# EAGLE design chordie_control_surface (EAGLE 5.10)
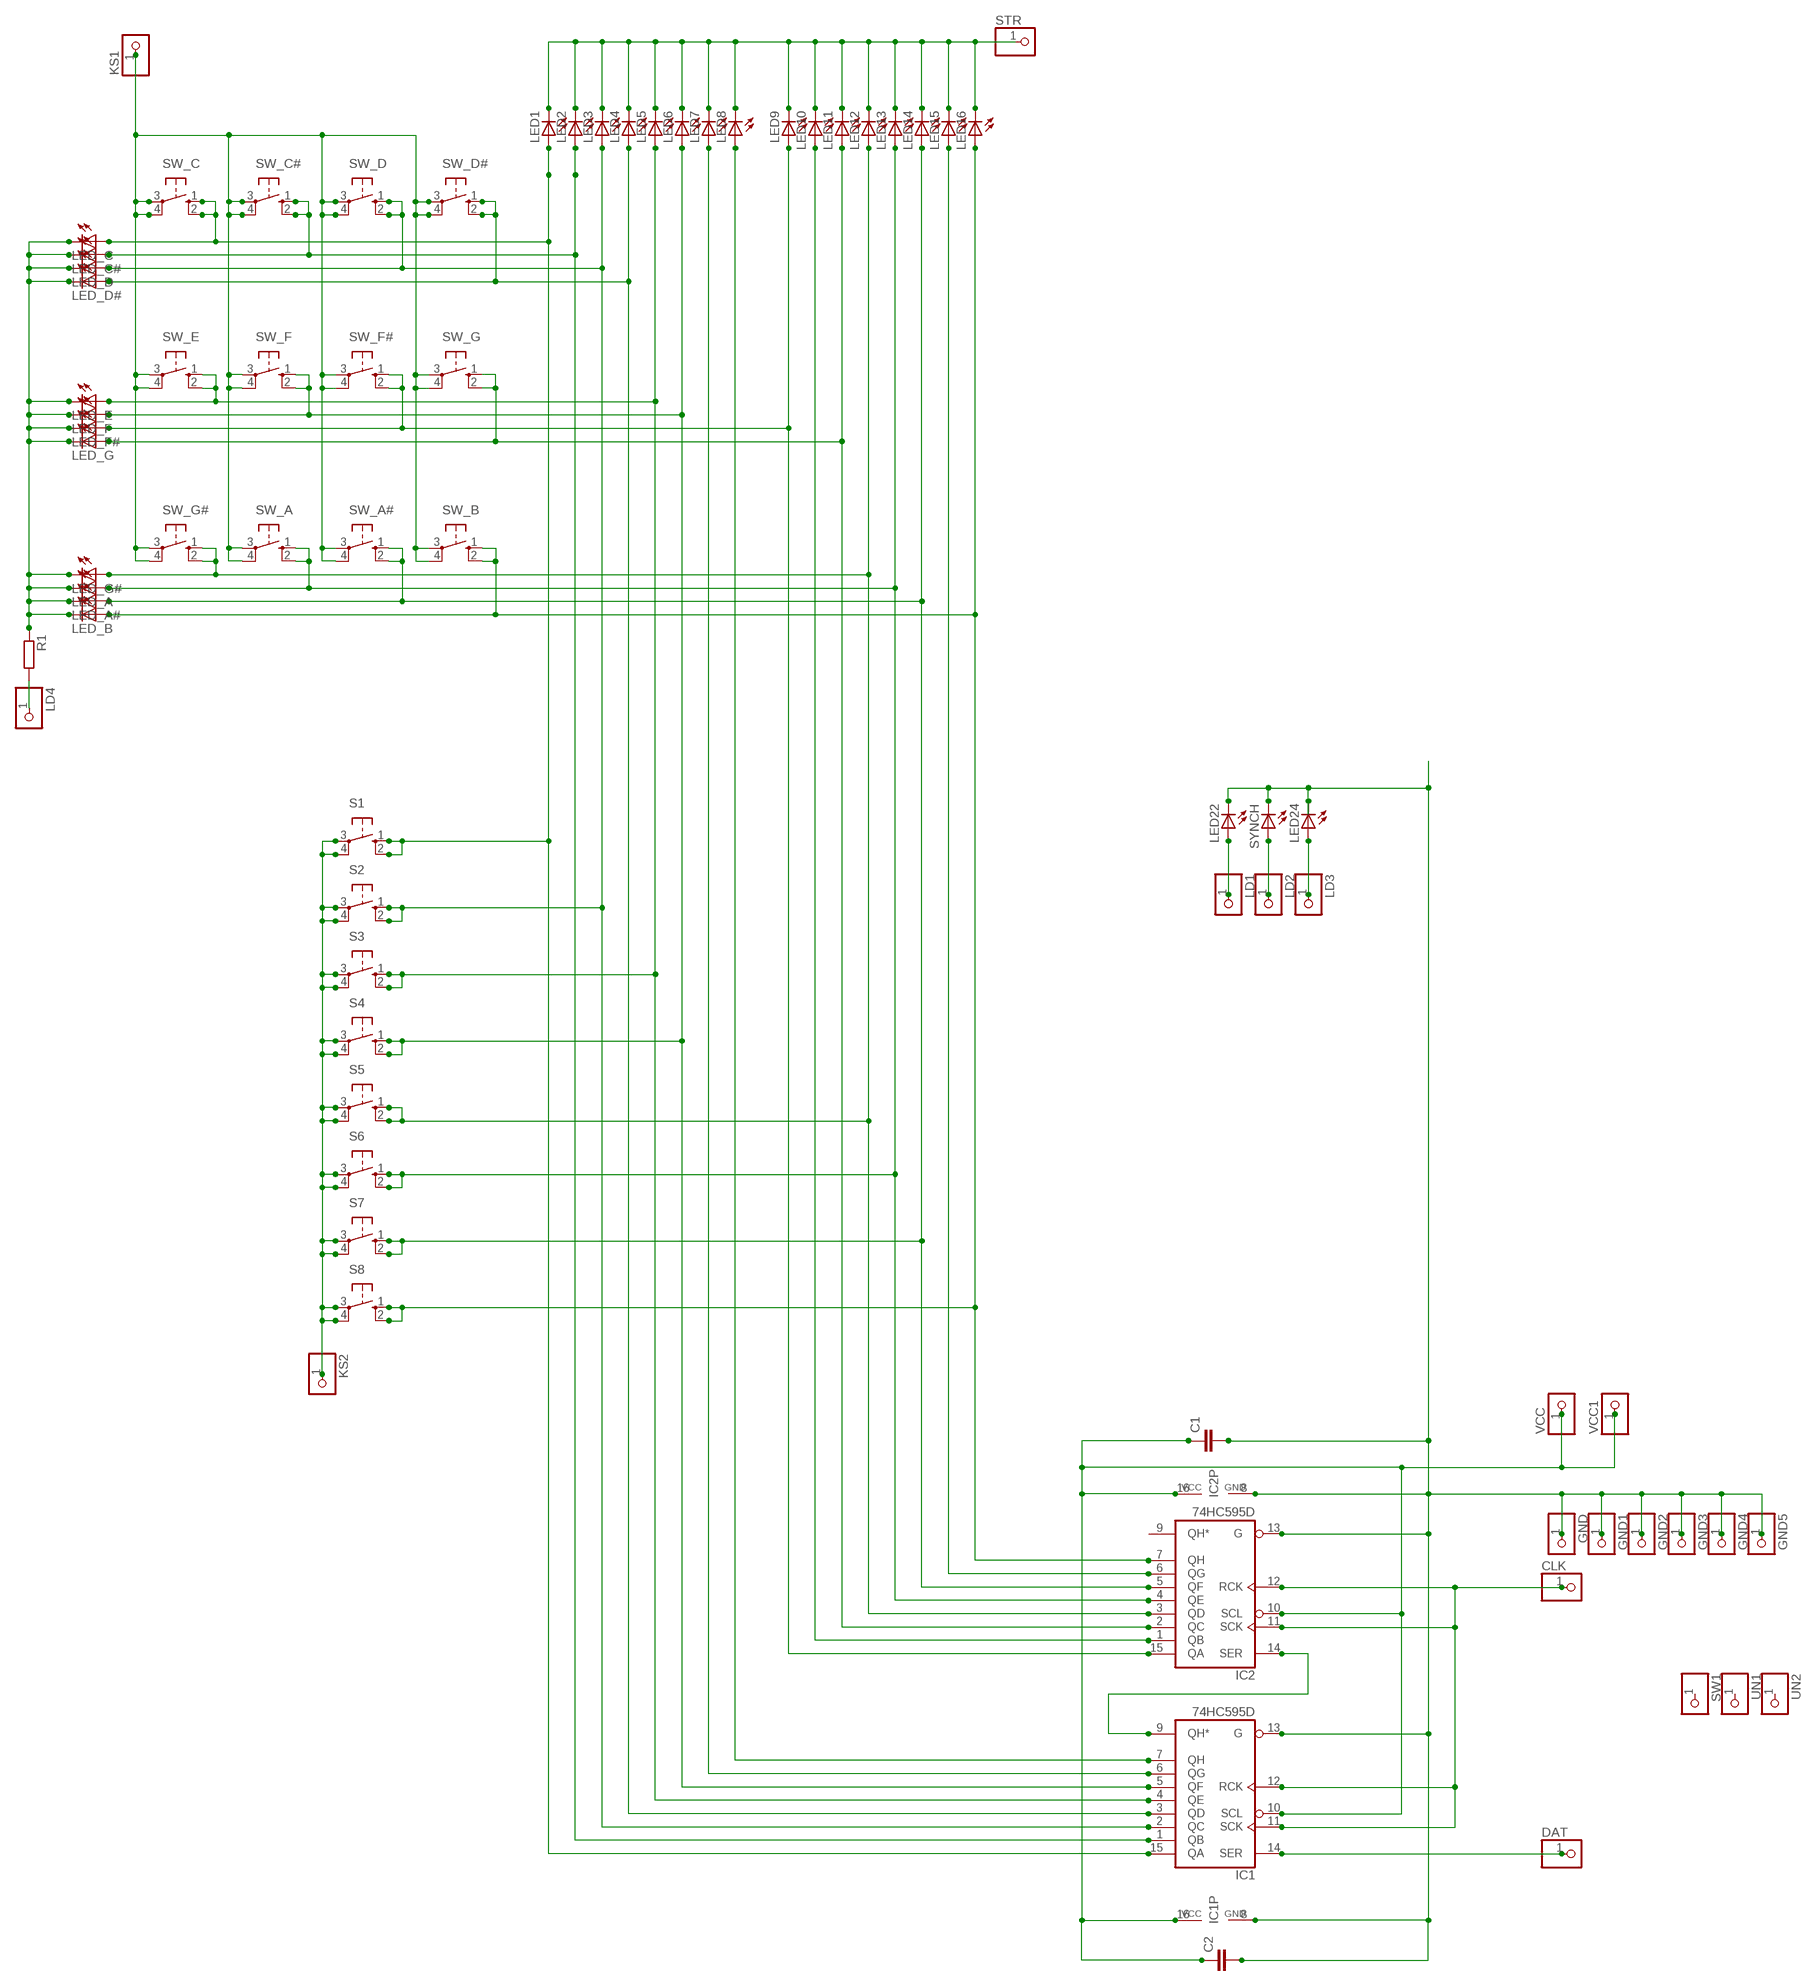
[diagram p0: schematic, sheet 1]

## Parts
C1  C-EUC0805  [C0805]
C2  C-EUC0805  [C0805]
CLK  PINHD-1X1  [1X01]
DAT  PINHD-1X1  [1X01]
GND  PINHD-1X1  [1X01]
GND1  PINHD-1X1  [1X01]
GND2  PINHD-1X1  [1X01]
GND3  PINHD-1X1  [1X01]
GND4  PINHD-1X1  [1X01]
GND5  PINHD-1X1  [1X01]
IC1  74HC595D  [SO16]
IC2  74HC595D  [SO16]
KS1  PINHD-1X1  [1X01]
KS2  PINHD-1X1  [1X01]
LD1  PINHD-1X1  [1X01]
LD2  PINHD-1X1  [1X01]
LD3  PINHD-1X1  [1X01]
LD4  PINHD-1X1  [1X01]
LED1  LED3MM  [LED3MM]
LED2  LED3MM  [LED3MM]
LED3  LED3MM  [LED3MM]
LED4  LED3MM  [LED3MM]
LED5  LED3MM  [LED3MM]
LED6  LED3MM  [LED3MM]
LED7  LED3MM  [LED3MM]
LED8  LED3MM  [LED3MM]
LED9  LED3MM  [LED3MM]
LED10  LED3MM  [LED3MM]
LED11  LED3MM  [LED3MM]
LED12  LED3MM  [LED3MM]
LED13  LED3MM  [LED3MM]
LED14  LED3MM  [LED3MM]
LED15  LED3MM  [LED3MM]
LED16  LED3MM  [LED3MM]
LED22  LED3MM  [LED3MM]
LED24  LED3MM  [LED3MM]
LED_A  LED3MM  [LED3MM]
LED_A#  LED3MM  [LED3MM]
LED_B  LED3MM  [LED3MM]
LED_C  LED3MM  [LED3MM]
LED_C#  LED3MM  [LED3MM]
LED_D  LED3MM  [LED3MM]
LED_D#  LED3MM  [LED3MM]
LED_E  LED3MM  [LED3MM]
LED_F  LED3MM  [LED3MM]
LED_F#  LED3MM  [LED3MM]
LED_G  LED3MM  [LED3MM]
LED_G#  LED3MM  [LED3MM]
R1  R-EU_R0805  [R0805]
S1  10-XX  [B3F-10XX]
S2  10-XX  [B3F-10XX]
S3  10-XX  [B3F-10XX]
S4  10-XX  [B3F-10XX]
S5  10-XX  [B3F-10XX]
S6  10-XX  [B3F-10XX]
S7  10-XX  [B3F-10XX]
S8  10-XX  [B3F-10XX]
STR  PINHD-1X1  [1X01]
SW1  PINHD-1X1  [1X01]
SW_A  40-XX  [B3F-40XX-NOTAB]
SW_A#  40-XX  [B3F-40XX-NOTAB]
SW_B  40-XX  [B3F-40XX-NOTAB]
SW_C  40-XX  [B3F-40XX-NOTAB]
SW_C#  40-XX  [B3F-40XX-NOTAB]
SW_D  40-XX  [B3F-40XX-NOTAB]
SW_D#  40-XX  [B3F-40XX-NOTAB]
SW_E  40-XX  [B3F-40XX-NOTAB]
SW_F  40-XX  [B3F-40XX-NOTAB]
SW_F#  40-XX  [B3F-40XX-NOTAB]
SW_G  40-XX  [B3F-40XX-NOTAB]
SW_G#  40-XX  [B3F-40XX-NOTAB]
SYNCH  LED3MM  [LED3MM]
UN1  PINHD-1X1  [1X01]
UN2  PINHD-1X1  [1X01]
VCC  PINHD-1X1  [1X01]
VCC1  PINHD-1X1  [1X01]

## Nets
DAT: DAT.1 IC1.14(SER)
GND: C1.2 C2.2 GND1.1 GND2.1 GND3.1 GND4.1 GND5.1 GND.1 IC1.8(GND) IC1.13(G) IC2.8(GND) IC2.13(G) LED22.K(C) LED24.K(C) SYNCH.K(C)
LED1: LD1.1 LED22.A
LED2: LD2.1 SYNCH.A
LED3: LD3.1 LED24.A
N$1: IC2.1(QB) LED10.A
N$2: IC1.6(QG) LED7.A
N$3: IC2.3(QD) LED12.A LED_G#.A S5.1(S) S5.2(S1) SW_G#.1(S) SW_G#.2(S1)
N$4: IC1.5(QF) LED6.A LED_F.A S4.1(S) S4.2(S1) SW_F.1(S) SW_F.2(S1)
N$5: IC2.4(QE) LED13.A LED_A.A S6.1(S) S6.2(S1) SW_A.1(S) SW_A.2(S1)
N$6: IC2.2(QC) LED11.A LED_G.A SW_G.1(S) SW_G.2(S1)
N$7: LED_A#.K(C) LED_A.K(C) LED_B.K(C) LED_C#.K(C) LED_C.K(C) LED_D#.K(C) LED_D.K(C) LED_E.K(C) LED_F#.K(C) LED_F.K(C) LED_G#.K(C) LED_G.K(C) R1.1
N$8: LD4.1 R1.2
N$11: KS2.1 S1.3(P) S1.4(P1) S2.3(P) S2.4(P1) S3.3(P) S3.4(P1) S4.3(P) S4.4(P1) S5.3(P) S5.4(P1) S6.3(P) S6.4(P1) S7.3(P) S7.4(P1) S8.3(P) S8.4(P1)
N$12: IC2.6(QG) LED15.A
N$13: IC1.7(QH) LED8.A
N$14: IC1.3(QD) LED4.A LED_D#.A SW_D#.1(S) SW_D#.2(S1)
N$16: IC2.7(QH) LED16.A LED_B.A S8.1(S) S8.2(S1) SW_B.1(S) SW_B.2(S1)
N$17: IC2.5(QF) LED14.A LED_A#.A S7.1(S) S7.2(S1) SW_A#.1(S) SW_A#.2(S1)
N$18: IC2.15(QA) LED9.A LED_F#.A SW_F#.1(S) SW_F#.2(S1)
N$19: LED1.K(C) LED2.K(C) LED3.K(C) LED4.K(C) LED5.K(C) LED6.K(C) LED7.K(C) LED8.K(C) LED9.K(C) LED10.K(C) LED11.K(C) LED12.K(C) LED13.K(C) LED14.K(C) LED15.K(C) LED16.K(C) STR.1
N$20: IC1.4(QE) LED5.A LED_E.A S3.1(S) S3.2(S1) SW_E.1(S) SW_E.2(S1)
N$21: IC1.2(QC) LED3.A LED_D.A S2.1(S) S2.2(S1) SW_D.1(S) SW_D.2(S1)
N$22: IC1.1(QB) LED2.A LED_C#.A SW_C#.1(S) SW_C#.2(S1)
N$23: IC1.15(QA) LED1.A LED_C.A S1.1(S) S1.2(S1) SW_C.1(S) SW_C.2(S1)
N$29: KS1.1 SW_A#.3(P) SW_A#.4(P1) SW_A.3(P) SW_A.4(P1) SW_B.3(P) SW_B.4(P1) SW_C#.3(P) SW_C#.4(P1) SW_C.3(P) SW_C.4(P1) SW_D#.3(P) SW_D#.4(P1) SW_D.3(P) SW_D.4(P1) SW_E.3(P) SW_E.4(P1) SW_F#.3(P) SW_F#.4(P1) SW_F.3(P) SW_F.4(P1) SW_G#.3(P) SW_G#.4(P1) SW_G.3(P) SW_G.4(P1)
N$30: IC1.9(QH*) IC2.14(SER)
SCK: CLK.1 IC1.11(SCK) IC1.12(RCK) IC2.11(SCK) IC2.12(RCK)
VCC: C1.1 C2.1 IC1.10(SCL) IC1.16(VCC) IC2.10(SCL) IC2.16(VCC) VCC1.1 VCC.1
Unconnected: IC2.9(QH*) SW1.1 UN1.1 UN2.1

## Library data of the parts
C1 C2 = rcl:C-EU: CAPACITOR, European symbol
CLK DAT GND GND1-GND5 KS1 KS2 LD1-LD4 STR SW1 UN1 UN2 VCC VCC1 = adafruit:PINHD-1X1: Pin header 1x1 for 0.1" spacing With round pins
IC1 IC2 = 74xx-eu:74*595: 8-bit SHIFT REGISTER, output latch
LED1-LED16 LED22 LED24 LED_A LED_A# LED_B LED_C LED_C# LED_D LED_D# LED_E LED_F LED_F# LED_G LED_G# SYNCH = adafruit:LED: LED OSRAM: - CHIPLED LG R971, LG N971, LY N971, LG Q971, LY Q971, LO R971, LY R971 LH N974, LH R974 LS Q976, LO Q976, LY Q976 LO Q996 - Hyper CHIPLED LW Q18S LB Q993, LB Q99A, LB R99A - SideLED LS A670, LO A670, LY A670, LG A670, LP A670 LB A673, LV A673, LT A673, LW A673 LH A674 LY A675 LS A676, LA A676, LO A676, LY A676, LW A676 LS A679, LY A679, LG A679 - Hyper Micro SIDELED® LS Y876, LA Y876, LO Y876, LY Y876 LT Y87S - SmartLED LW L88C, LW L88S LB L89C, LB L89S, LG L890 LS L89K, LO L89K, LY L89K LS L896, LA L896, LO L896, LY L896 - TOPLED LS T670, LO T670, LY T670, LG T670, LP T670 LSG T670, LSP T670, LSY T670, LOP T670, LYG T670 LG T671, LOG T671, LSG T671 LB T673, LV T673, LT T673, LW T673 LH T674 LS T676, LA T676, LO T676, LY T676, LB T676, LH T676, LSB T676, LW T676 LB T67C, LV T67C, LT T67C, LS T67K, LO T67K, LY T67K, LW E67C LS E67B, LA E67B, LO E67B, LY E67B, LB E67C, LV E67C, LT E67C LW T67C LS T679, LY T679, LG T679 LS T770, LO T770, LY T770, LG T770, LP T770 LB T773, LV T773, LT T773, LW T773 LH T774 LS E675, LA E675, LY E675, LS T675 LS T776, LA T776, LO T776, LY T776, LB T776 LHGB T686 LT T68C, LB T68C - Hyper Mini TOPLED® LB M676 - Mini TOPLED Santana® LG M470 LS M47K, LO M47K, LY M47K Source: http://www.osram.convergy.de/
R1 = rcl:R-EU_: RESISTOR, European symbol
S1-S8 = switch-omron:10-XX: OMRON SWITCH
SW_A SW_A# SW_B SW_C SW_C# SW_D SW_D# SW_E SW_F SW_F# SW_G SW_G# = jasons_stuff:40-XX: OMRON SWITCH

## Board
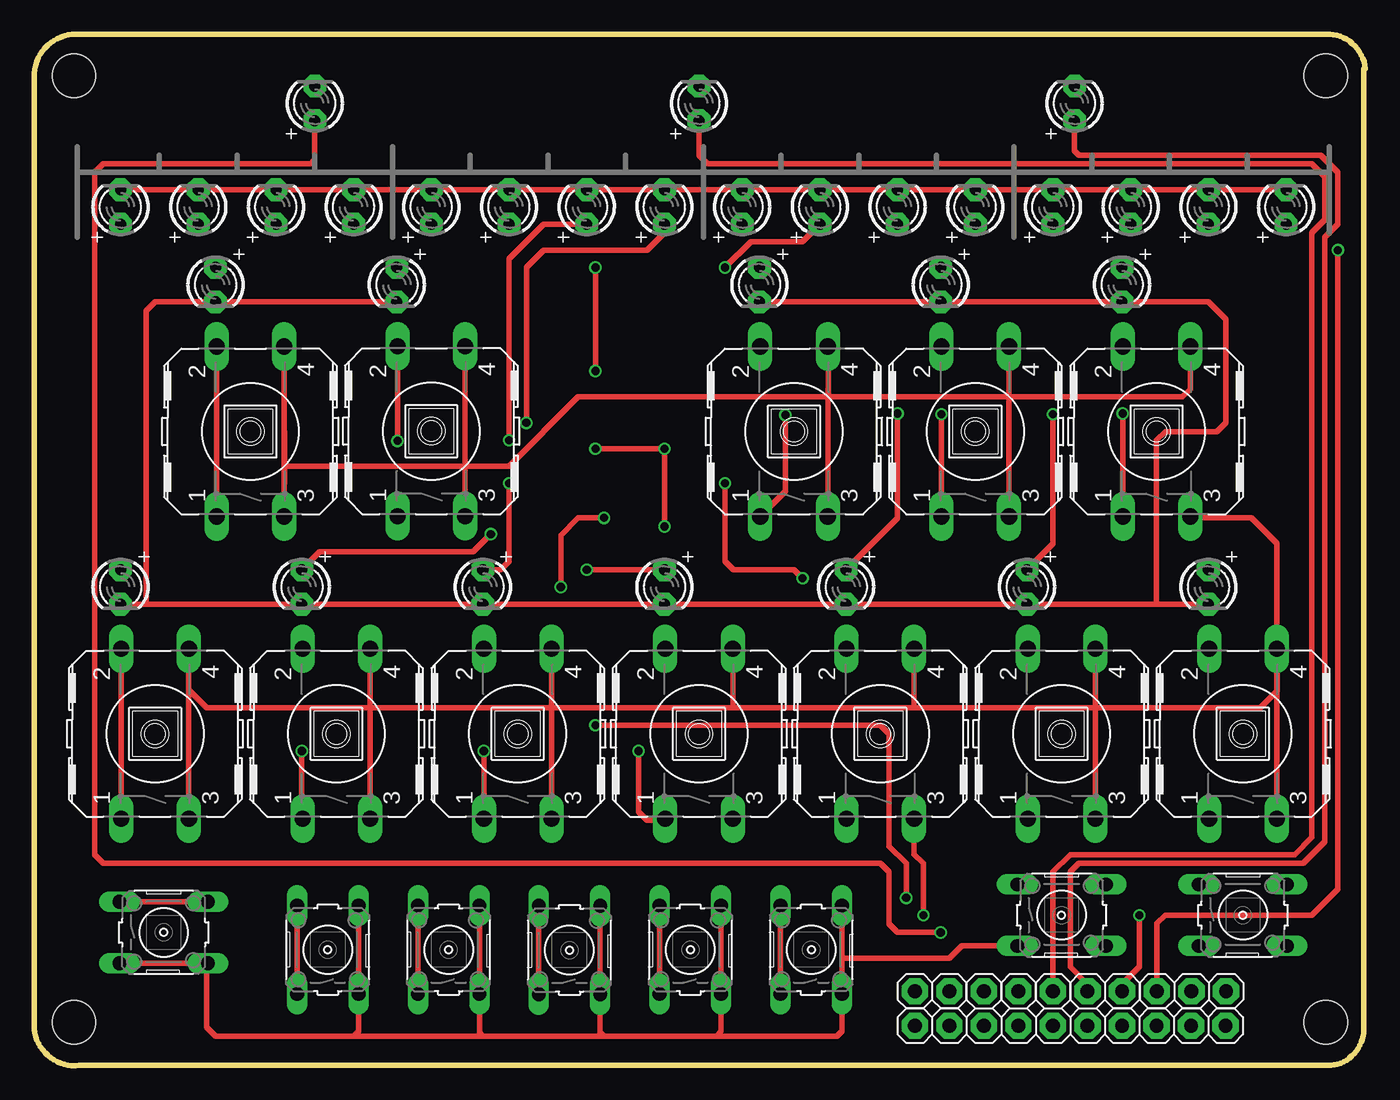
[diagram p1: board, top side]
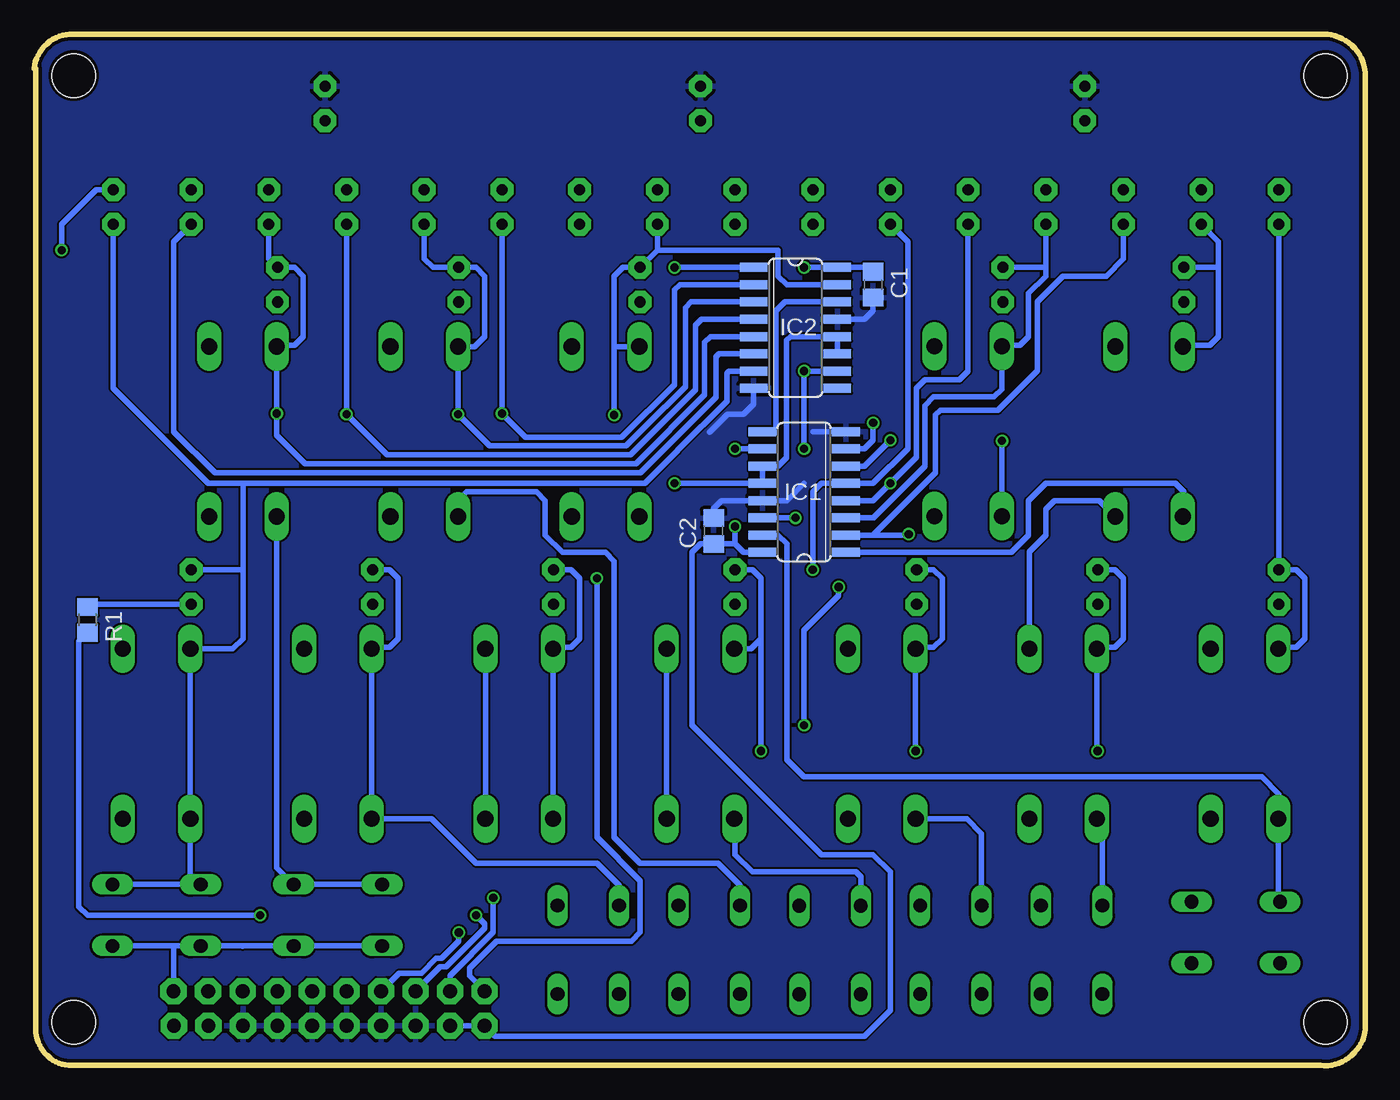
[diagram p2: board, bottom side, seen from below]

Size 97.93 x 75.85 mm. Coordinates in mm from the lower left corner, seen from the top.
Outline: 97.93,73.3 arc90 94.76,75.84 2.81,75.84 arc90 0.02,72.41 0.02,2.68 arc90 3.32,0.02 95.14,0.02 arc90 97.81,2.68 97.81,73.3
Copper layers (1*16): Top 0.035mm / dielectric 1.5mm / Bottom 0.035mm
Design rules "ITEADstudio_DRC": minimum track width 6mil, minimum drill 12mil, track to track 6mil, track to pad 6mil, pad to pad 6mil, via to via 6mil, smd to smd 0mil, copper to edge 10mil, drill to drill 10mil, minimum pad ring 10mil, minimum via ring 6mil, stop-mask expansion 2mil, vias tented up to drill 100mil, thermal gap 10mil
Holes 3.2 mm at 2.94,72.79 2.94,3.19 95.01,72.79 95.01,3.19

### Footprints (pad centres in the part's own frame; a part is rotated, then mirrored left to right if it is on the bottom)
C0805 = smd 1.3 x 1.5: 1 -0.95,0; 2 0.95,0
1X01 = drill 1.016 pad 1.93 octagon: 1 0,0
SO16 = smd 0.66 x 2.032: 1 -4.445,-3.073; 2 -3.175,-3.073; 3 -1.905,-3.073; 4 -0.635,-3.073; 5 0.635,-3.073; 6 1.905,-3.073; 7 3.175,-3.073; 8 4.445,-3.073; 9 4.445,3.073; 10 3.175,3.073; 11 1.905,3.073; 12 0.635,3.073; 13 -0.635,3.073; 14 -1.905,3.073; 15 -3.175,3.073; 16 -4.445,3.073
LED3MM = drill 0.813 pad 1.676 octagon: A -1.27,0; K 1.27,0
R0805 = smd 1.3 x 1.5: 1 -0.95,0; 2 0.95,0
B3F-10XX = drill 1.016 long: 1 -3.251,2.261; 2 3.251,2.261; 3 -3.251,-2.261; 4 3.251,-2.261
B3F-40XX-NOTAB = drill 1.194 long: 1 -6.248,2.489; 2 6.248,2.489; 3 -6.248,-2.489; 4 6.248,-2.489

### Placement (x,y rotation side)
C1  36.21,57.42 270 bottom
C2  47.95,39.31 90 bottom
CLK  64.79,5.48 0 top
DAT  67.33,5.48 0 top
GND  80.03,2.94 0 top
GND1  82.57,2.94 0 top
GND2  77.49,2.94 0 top
GND3  74.95,2.94 0 top
GND4  72.41,2.94 0 top
GND5  69.87,2.94 0 top
IC1  41.29,42.18 90 bottom
IC2  41.93,54.25 270 bottom
KS1  69.87,5.48 90 top
KS2  87.67,5.48 0 top
LD1  72.41,5.48 90 top
LD2  74.95,5.48 90 top
LD3  77.49,5.48 90 top
LD4  80.03,5.48 0 top
LED1  6.37,63.14 90 top
LED2  12.08,63.14 90 top
LED3  17.8,63.14 90 top
LED4  23.51,63.14 90 top
LED5  29.23,63.14 90 top
LED6  34.94,63.14 90 top
LED7  40.66,63.14 90 top
LED8  46.37,63.14 90 top
LED9  52.09,63.14 90 top
LED10  57.8,63.14 90 top
LED11  63.52,63.14 90 top
LED12  69.23,63.14 90 top
LED13  74.95,63.14 90 top
LED14  80.66,63.14 90 top
LED15  86.38,63.14 90 top
LED16  92.09,63.14 90 top
LED22  20.65,70.76 90 top
LED24  76.53,70.76 90 top
LED_A  73.04,35.2 270 top
LED_A#  80.03,57.42 270 top
LED_B  86.38,35.2 270 top
LED_C  6.37,35.2 270 top
LED_C#  13.35,57.42 270 top
LED_D  19.7,35.2 270 top
LED_D#  26.69,57.42 270 top
LED_E  33.01,35.2 270 top
LED_F  46.37,35.2 270 top
LED_F#  53.36,57.42 270 top
LED_G  59.73,35.2 270 top
LED_G#  66.69,57.42 270 top
R1  94,32.78 270 bottom
S1  9.54,9.8 0 top
S2  21.61,8.53 90 top
S3  30.5,8.53 90 top
S4  39.39,8.5 90 top
S5  48.28,8.53 90 top
S6  57.17,8.53 90 top
S7  75.58,11.07 0 top
S8  88.92,11.07 0 top
STR  82.59,5.48 0 top
SW1  85.13,5.48 0 top
SW_A  75.58,24.4 90 top
SW_A#  82.57,46.63 90 top
SW_B  88.92,24.4 90 top
SW_C  8.91,24.4 90 top
SW_C#  15.92,46.63 90 top
SW_D  22.24,24.4 90 top
SW_D#  29.23,46.65 90 top
SW_E  35.58,24.4 90 top
SW_F  48.91,24.4 90 top
SW_F#  55.9,46.63 90 top
SW_G  62.25,24.4 90 top
SW_G#  69.23,46.63 90 top
SYNCH  48.91,70.76 90 top
UN1  85.11,2.94 0 top
UN2  87.65,2.94 0 top
VCC  64.79,2.94 0 top
VCC1  67.33,2.94 0 top

### Tracks (layer width: path | path; a pad name or v marks a point on that pad's centre or on a via)
DAT  (via drill 0.6)
  Top 0.406: v41.93,40.28 40.02,40.28 38.75,39.01 v38.75,35.2 | v64.15,12.34 64.15,14.88 62.88,16.15 62.88,24.4 62.25,25.04 v41.29,25.04
  Bottom 0.406: v41.93,40.28 IC1.14 | v38.75,35.2 38.75,34.56 41.29,32.02 v41.29,25.04 | v64.15,12.34 64.15,9.8 67.33,6.62 DAT.1
GND
  Bottom 0.406: IC2.13 36.85,54.88 36.21,55.52 C1.2 | IC2.8 45,48.63 45.74,47.9 46.93,47.9 48.25,46.57 | 48.25,40.57 C2.2 47.95,40.96 47.36,41.55 IC1.13 42.56,41.55 41.29,42.82 | IC1.8 40.66,46.63
  pour Bottom: -1.89,77.11 99.08,77.11 99.08,-1.63 -1.89,-1.63
LED1  (via drill 0.6)
  Top 0.406: LED22.A 20.65,66.63 20.34,66.31 5.1,66.31 4.46,65.68 4.46,15.51 5.1,14.88 62.25,14.88 62.88,14.24 62.88,10.43 63.52,9.8 v66.69,9.8
  Bottom 0.406: LD1.1 71.09,6.8 69.43,6.8 68.34,7.89 67.96,7.89 66.69,9.16 v66.69,9.8
LED2
  Top 0.406: SYNCH.A 48.91,66.95 49.55,66.31 94,66.31 94.95,65.36 94.95,62.18 94,61.23 94,16.78 92.73,15.51 76.22,15.51 74.95,14.24 LD2.1
LED3
  Top 0.406: LD3.1 77.49,5.99 76.22,7.26 76.22,14.24 76.85,14.88 93.36,14.88 94.95,16.46 94.95,60.91 95.9,61.87 95.9,65.68 94.63,66.95 76.85,66.95 76.53,67.26 LED24.A
N$1  (via drill 0.6)
  Top 0.406: LED10.A 56.53,60.6 52.72,60.6 v50.82,58.69
  Bottom 0.406: IC2.1 v50.82,58.69
N$2  (via drill 0.6)
  Top 0.406: v34.94,45.99 34.94,59.33 37.48,61.87 LED7.A
  Bottom 0.406: IC1.6 36.85,44.09 v34.94,45.99
N$3  (via drill 0.6)
  Top 0.406: SW_G#.1 v66.74,47.9 | S5.1 S5.2
  Bottom 0.406: IC2.3 49.6,56.15 50.03,55.72 50.03,49.9 51.48,48.45 51.53,48.45 54.4,45.58 64.43,45.58 v66.74,47.9 SW_G#.2 65.52,52.87 64.79,53.61 64.79,58.06 65.42,58.69 LED_G#.A 68.6,58.69 69.23,59.33 LED12.A | S5.2 46.02,13.25 47.64,14.88 53.36,14.88 55.26,16.78 55.26,37.1 55.9,37.74 59.07,37.74 60.34,39.01 60.34,41.55 60.98,42.18 66.11,42.18 66.74,41.55 SW_G#.1 | SW_G#.1 66.69,40.33 | SW_G#.1 66.64,40.28
N$4  (via drill 0.6)
  Top 0.406: S4.1 S4.2 | v44.47,23.13 44.47,18.69 45.1,18.05 46.32,18.05 SW_F.1 | LED_F.A v40.66,36.47
  Bottom 0.406: LED6.A 33.67,60.6 33.67,45.36 36.21,42.82 IC1.5 40.02,42.82 40.66,42.18 v40.66,36.47 | S4.2 37.13,13.88 37.48,14.24 45.1,14.24 46.37,15.51 46.37,18.1 SW_F.1 | SW_F.2 45.2,30.65 44.47,31.39 | v44.47,23.13 44.47,31.39 | LED_F.A 45.1,36.47 44.47,35.83 44.47,31.39
N$5  (via drill 0.6)
  Top 0.406: LED_A.A 74.95,38.37 v74.95,47.9 | S6.1 S6.2
  Bottom 0.406: IC2.4 48.84,54.88 49.29,54.42 49.29,49.7 54.07,44.92 71.97,44.92 v74.95,47.9 LED13.A | S6.2 54.91,13.25 56.53,14.88 65.42,14.88 68.7,18.15 SW_A.1 SW_A.2 72.99,30.75 71.77,30.75 71.14,31.39 71.14,35.83 71.77,36.47 LED_A.A
N$6  (via drill 0.6)
  Top 0.406: v63.52,47.95 63.52,40.25 LED_G.A
  Bottom 0.406: IC2.2 50.44,57.42 50.82,57.04 50.82,50.08 54.7,46.19 61.76,46.19 v63.52,47.95 LED11.A | LED_G.A 58.44,36.47 57.8,35.83 57.8,31.39 58.44,30.75 59.66,30.75 SW_G.2 SW_G.1
N$7
  Top 0.406: LED_F#.K LED_G#.K LED_A#.K 86.38,56.15 87.65,54.88 87.65,47.26 87.01,46.63 83.2,46.63 82.57,45.99 82.57,33.93 | LED_D#.K LED_C#.K 8.91,56.15 8.27,55.52 8.27,33.93 | 82.57,33.93 LED_B.K | 82.57,33.93 LED_A.K LED_G.K LED_F.K LED_E.K LED_D.K 8.27,33.93 | LED_C.K 8.27,33.93
  Bottom 0.406: LED_B.K 93.8,33.93 R1.1
N$8  (via drill 0.6)
  Top 0.406: 80.15,5.48 LD4.1 80.03,5.99 81.3,7.26 v81.3,11.07
  Bottom 0.406: v81.3,11.07 94,11.07 94.63,11.7 94.63,31.2 R1.2
N$11
  Top 0.406: 23.51,2.18 13.35,2.18 12.72,2.81 12.72,7.46 S1.4 S1.3 | 23.51,2.18 33.04,2.18 | 33.04,2.18 41.93,2.18 | 41.93,2.18 50.18,2.18 | 50.18,2.18 59.07,2.18 59.43,2.53 S6.3 59.43,7.89 | 23.51,2.18 23.87,2.53 S2.3 S2.4 | 33.04,2.18 32.76,2.45 S3.3 S3.4 | 41.93,2.18 41.65,2.45 S4.3 S4.4 | 50.18,2.18 50.54,2.53 S5.3 S5.4 | 59.43,7.89 S6.4 | S7.3 68.24,8.8 67.33,7.89 59.43,7.89
  Bottom 0.406: S8.3 85.74,8.73 | 82.57,8.8 S7.4 S7.3 | 82.57,8.8 S8.3 | S8.3 87.65,8.8 | 87.65,8.8 S8.4 | 82.57,8.8 82.59,8.78 | KS2.1 87.67,8.78 87.65,8.8
N$12
  Bottom 0.406: IC2.6 47.57,52.34 47.77,52.14 47.77,49.14 53.33,43.58 84.6,43.58 87.65,46.63 87.65,60.6 LED15.A
N$13  (via drill 0.6)
  Top 0.406: v36.21,47.26 36.21,58.69 37.48,59.96 45.1,59.96 46.37,61.23 LED8.A
  Bottom 0.406: IC1.7 36.85,45.36 36.21,45.99 v36.21,47.26
N$14  (via drill 0.6)
  Top 0.406: 26.66,52.98 SW_D#.2 v26.74,45.94
  Bottom 0.406: IC1.3 36.16,40.28 36.16,40.33 32.4,44.09 32.4,48.53 31.77,49.17 27.32,49.17 26.74,49.75 SW_D#.2 26.66,52.98 25.42,52.98 24.78,53.61 24.78,56.79 23.51,58.06 23.51,58.69 | 23.51,58.69 LED4.A | 23.51,58.69 LED_D#.A | SW_D#.1 v26.74,45.94
N$16
  Bottom 0.406: IC2.7 46.83,51.07 46.98,50.92 46.98,48.86 50.59,45.25 50.59,45.23 53,42.82 82.57,42.82 | 82.57,42.82 85.11,42.82 92.09,49.8 LED16.A | 82.57,42.82 82.57,36.47 | 82.57,36.47 82.57,31.39 83.3,30.65 SW_B.2 SW_B.1 86.43,14.09 S8.1 S8.2 | 82.57,36.47 LED_B.A
N$17  (via drill 0.6)
  Top 0.406: SW_A#.1 v80.08,47.95
  Bottom 0.406: IC2.5 48.17,53.61 48.61,53.18 48.61,49.32 53.66,44.26 77.98,44.26 80.08,46.36 v80.08,47.95 SW_A#.2 79.98,52.98 78.76,52.98 78.12,53.61 78.12,58.06 78.76,58.69 LED_A#.A 80.66,59.33 LED14.A | SW_A#.1 80.08,14.57 S7.2 S7.1
N$18  (via drill 0.6)
  Top 0.406: v55.26,47.84 55.26,42.23 SW_F#.1
  Bottom 0.406: 52.09,59.96 43.2,59.96 43.2,58.06 42.56,57.42 IC2.15 | 52.09,59.96 LED_F#.A 54.63,58.69 55.26,58.06 55.26,52.98 | 52.09,59.96 LED9.A | v55.26,47.84 55.26,52.98 | SW_F#.2 55.16,52.87 55.26,52.98
N$19  (via drill 0.6)
  Top 0.406: LED1.K LED2.K LED3.K LED4.K LED5.K LED6.K LED7.K LED8.K LED9.K LED10.K LED11.K LED12.K LED13.K LED14.K | LED14.K LED15.K LED16.K LED14.K | STR.1 82.59,10.46 83.2,11.07 94,11.07 95.9,12.97 v95.9,59.96
  Bottom 0.406: v95.9,59.96 95.9,61.87 93.36,64.41 LED16.K
N$20  (via drill 0.6)
  Top 0.406: LED_E.A 34.31,36.47 34.94,37.1 v34.94,42.82 | S3.1 S3.2 | SW_E.1 v33.09,23.13
  Bottom 0.406: IC1.4 36.21,41.55 v34.94,42.82 33.04,44.72 33.04,49.8 32.4,50.44 29.86,50.44 29.23,51.07 LED5.A | SW_E.1 29.33,18.15 28.24,17.06 S3.2 | v33.09,23.13 SW_E.2 32.99,30.75 31.77,30.75 31.13,31.39 31.13,35.83 31.77,36.47 LED_E.A
N$21  (via drill 0.6)
  Top 0.406: S2.1 S2.2 | LED_D.A 21.02,37.79 32.3,37.79 v33.6,39.08 | v19.7,23.13 19.7,18.2 SW_D.1
  Bottom 0.406: 36.21,39.01 IC1.2 | LED3.A 17.8,59.33 19.07,58.06 22.24,58.06 24.15,56.15 24.15,51.1 27.04,48.2 31.28,48.2 31.64,47.84 31.64,43.58 36.21,39.01 | LED_D.A 18.43,36.47 17.8,35.83 17.8,31.39 18.43,30.75 19.65,30.75 SW_D.2 19.75,23.18 v19.7,23.13 | S2.2 19.35,17.75 SW_D.1 | 36.21,39.01 33.67,39.01 v33.6,39.08
N$22
  Top 0.406: SW_C#.1 SW_C#.2
  Bottom 0.406: IC1.1 26.05,37.74 24.78,39.01 24.78,41.55 23.51,42.82 13.99,42.82 13.35,42.18 13.35,40.45 SW_C#.1 | LED2.A 10.81,60.6 10.81,58.69 | 10.81,58.69 10.81,53.61 11.45,52.98 13.33,52.98 SW_C#.2 | 10.81,58.69 LED_C#.A
N$23
  Top 0.406: SW_C.1 SW_C.2 | S1.1 S1.2
  Bottom 0.406: IC1.15 43.2,39.01 42.56,38.37 42.56,22.5 41.29,21.23 7.64,21.23 6.37,19.96 6.37,18.2 SW_C.1 6.42,12.18 S1.1 | LED1.A LED_C.A 5.1,36.47 4.46,35.83 4.46,31.39 5.1,30.75 6.32,30.75 SW_C.2
N$29  (via drill 0.6)
  Top 0.406: 24.78,26.31 12.72,26.31 11.4,27.63 SW_C.4 SW_C.3 | 24.78,26.31 38.12,26.31 | 38.12,26.31 51.45,26.31 | 51.45,26.31 64.79,26.31 | 64.79,26.31 78.12,26.31 | 78.12,26.31 90.19,26.31 91.46,27.58 91.46,30.6 SW_B.4 | 78.07,26.36 SW_A.4 | 78.12,26.31 78.07,26.36 | SW_G.4 64.74,26.36 64.79,26.31 | SW_F.4 51.4,26.36 51.45,26.31 | SW_E.4 38.07,26.36 38.12,26.31 | SW_D.4 24.73,26.36 24.78,26.31 | 58.44,49.8 58.44,49.17 71.77,49.17 | 58.44,49.8 58.44,52.82 SW_F#.4 | SW_B.4 91.41,38.42 89.55,40.28 85.16,40.28 SW_A#.3 | SW_G#.4 71.72,49.22 71.77,49.17 | SW_A#.4 85.06,49.75 84.47,49.17 71.77,49.17 | SW_D.3 24.73,26.25 24.78,26.31 | SW_E.3 38.07,26.25 38.12,26.31 | SW_B.4 SW_B.3 | SW_C#.3 18.41,46.65 | 31.72,44.09 SW_D#.3 | 31.72,44.09 SW_D#.4 | 78.07,26.36 SW_A.3 | 58.39,49.17 SW_F#.3 | 58.39,49.17 58.39,49.75 58.44,49.8 | SW_G#.3 71.72,49.11 71.77,49.17 | 58.39,49.17 40.02,49.17 34.94,44.09 31.72,44.09 | SW_G.3 64.74,15.56 65.42,14.88 v65.42,11.07 | 18.41,46.65 SW_C#.4 | 18.41,46.65 18.43,46.63 18.43,44.09 | 18.43,44.09 18.43,42.82 | 18.43,44.09 31.72,44.09
  Bottom 0.406: SW_F.4 SW_F.3 | SW_G.4 SW_G.3 | SW_D.4 24.73,37.79 23.51,39.01 23.51,40.91 22.88,41.55 19.57,41.55 SW_C#.3 | SW_A.3 78.12,18.1 | KS1.1 68.06,7.28 67.62,7.28 64.79,10.11 64.79,10.43 v65.42,11.07
N$30
  Bottom 0.406: IC1.9 43.35,46.55 43.35,55.49 42.69,56.15 IC2.14
SCK  (via drill 0.6)
  Top 0.406: v50.82,42.82 50.82,37.1 51.45,36.47 55.9,36.47 v56.53,35.83
  Bottom 0.406: IC2.12 38.75,53.61 | IC2.12 IC2.11 | IC2.12 42.31,53.61 42.59,53.33 42.59,44.7 43.2,44.09 IC1.11 IC1.12 v50.82,42.82 | v56.53,35.83 56.53,16.78 53.36,13.61 53.36,9.8 53.99,9.16 63.9,9.16 65.9,7.15 65.9,6.6 CLK.1
VCC  (via drill 0.6)
  Top 0.406: v41.29,51.07 v41.29,58.69 | v46.37,39.64 v46.37,45.36 v41.29,45.36
  Bottom 0.406: C1.1 36.53,58.69 IC2.16 v41.29,58.69 | IC1.16 45.74,37.74 46.37,38.37 | v41.29,45.36 v41.29,51.07 IC2.10 | VCC1.1 VCC.1 64.02,2.18 36.85,2.18 34.94,4.08 34.94,14.24 36.21,15.51 40.02,15.51 49.55,25.04 49.55,37.74 48.92,38.36 C2.1 47.94,38.37 46.37,38.37 | v46.37,45.36 IC1.10 | 46.37,38.37 v46.37,39.64

### Text on the board
tDocu: [1] | [5] | [9] | [13] | DEC | INC | SHFT | (1) | (2) | (3) | (4) | (5)
bDocu: hotchk155 | chordie control surface rev 1.0